# Altium schematic sheet Schematic - Power Driver.SchDoc
size A; SheetNumber: 1; SheetTotal: 2
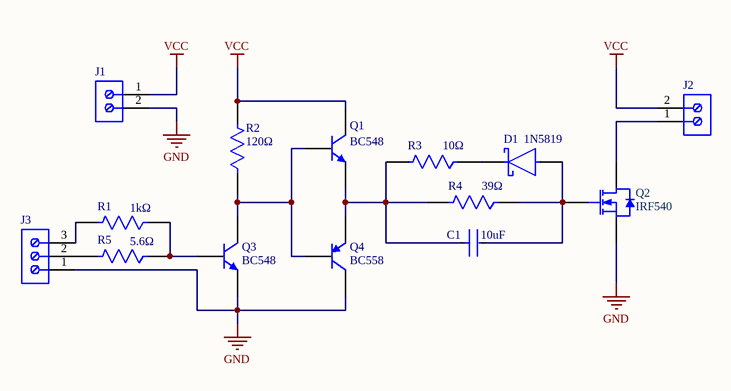
[diagram p0: Schematic - Power Driver.SchDoc]

## Parts
C1  10uF  [FP-BFC233860472-MFG]
D1  1N5819  [FP-1N5819-E3-54-MFG]
J1  1725656  [PHOE-1725656-2]  (value not drawn)
J2  1725656  [PHOE-1725656-2]  (value not drawn)
J3  691214110003  [691214110003]  (value not drawn)
Q1  BC548  [ONSC-TO-92-3-29-11_AM_BL]
Q2  IRF540  [VISH-TO-220AB-3_A]
Q3  BC548  [ONSC-TO-92-3-29-11_AM_BL]
Q4  BC558  [ONSC-TO-92-3-29-11_AM_BL]
R1  1kΩ  [FP-CF14-MFG]
R2  120Ω  [FP-CF14-MFG]
R3  10Ω  [FP-CF14-MFG]
R4  39Ω  [FP-CF14-MFG]
R5  5.6Ω  [FP-CF14-MFG]

## Nets
GND: J1.2 J3.1 Q2.3(S) Q3.3(E) Q4.1(C)
VCC: J1.1 J2.2 Q1.1(C) R2.2
NetC1_1: C1.1 Q1.3(E) Q4.3(E) R3.2 R4.2
NetC1_2: C1.2 D1.2(A) Q2.1(G) R4.1
NetD1_1: D1.1(C) R3.1
NetJ2_1: J2.1 Q2.2(D)
NetJ3_2: J3.2 R5.2
NetJ3_3: J3.3 R1.2
NetQ1_2: Q1.2(B) Q3.1(C) Q4.2(B) R2.1
NetQ3_2: Q3.2(B) R1.1 R5.1

## Library data of the parts
C1 = CMP-2000-05947-2: CAP FILM 4700PF 20% 1KVDC RADIAL; Dielectric: PP; Insulation Resistance: 15GR; Capacitance: 4.7nF; Voltage Rating (AC): 300V; Lead Length: 3.5mm; Lead Diameter: 0.5mm; Voltage Rating (DC): 1kV; Tolerance: 5%; Series: MKP338 6 Y2; Height - Seated (Max): 0.453inch; Max Operating Temperature: 105°C; Min Operating Temperature: -55°C; Case/Package: Radial; Dielectric Material: PP; Mount: Through Hole; Construction: RADIAL; Termination: Radial; Lead Pitch: 7.5mm; Length: 10mm; Radiation Hardening: No; Voltage: 300V; Contact Plating: Tin; Width: 6mm; Package Quantity: 750; RoHS Compliant: Yes; Depth: 6mm; Packaging: Bulk; Height: 11.5mm; Lead Free: Lead Free
D1 = CMP-02539-000037-2: DIODE SCHOTTKY 40V 1A DO204AL; Capacitance: 110pF; Element Configuration: Single; Peak Non-Repetitive Surge Current: 25A; Forward Voltage: 900mV; Polarity: Standard; Peak Reverse Current: 1mA; Max Operating Temperature: 125°C; Forward Current: 1A; Package Quantity: 1; Average Rectified Current: 1A; Voltage: 40V; Radiation Hardening: No; Current: 1A; Max Reverse Voltage (DC): 40V; Height: 2.7mm; Output Current: 1A; Lead Free: Lead Free; Diameter: 2.7mm; Min Operating Temperature: -65°C; Max Repetitive Reverse Voltage (Vrrm): 40V; Number of Pins: 2; Width: 2.7mm; Length: 5.2mm; Current Rating: 1A; Packaging: Tape and Reel; Mount: Through Hole; Max Forward Surge Current (Ifsm): 25A; Voltage Rating (DC): 40V
J1 J2 = CMP-2000-05299-1: Male Header, Pitch 2.54 mm, 1 x 2 Position, Height 9 mm, Tail Length 3.5 mm; Manufacturer: Phoenix Contact; Number of contacts: 2; Content: 250pc(s); Pitch: 2.54mm; Industrial packaging: Yes; Colour: Green; Manufacturer part No.: 1725656; Type: MPT0,5/2-2,54; Datasheet URL: http://datasheet.octopart.com/1725656-Phoenix-Contact-datasheet-5302866.pdf; Manufacturer URL: http://www.phoenixcontact.com/; Datasheet Version: Apr-08
J3 = CMP-1502-02466-2: NexarPartId: 18818289; Number of Levels: 1; Voltage: 300V; Pitch: 3.5052mm; Stripping Length: -6mm; Number of Positions Per Level: 3; Plating: Brass, Steel; Wire/Cable Gauge: 24AWG; Wire Gauge (Min): 16AWG; Current Rating: 10A; Width: 10.9mm; Length: 7.4mm; Housing Material: Nylon; Height: 12.2mm; Min Operating Temperature: -40°C; Contact Plating: Brass, Tin; Packaging: Box; Color: Blue, Green; Number of Contacts: 3; Number of Pins: 3; Voltage Rating: 300V; Termination: Screw; Lead Pitch: 3.5mm; Max Operating Temperature: 105°C; Mount: Through Hole; Contact Material: Brass; RoHS: Compliant; Wire Gauge (Max): 24AWG; Current: 10A; REACH SVHC: Unknown
Q1 Q3 = CMP-1048-01603-1: Amplifier Transistor, NPN Silicon, 3-Pin TO-92, Pb-Free, Tape and Reel; Manufacturer: On Semiconductor; PartNumber: BC548BRL1G; fT Min (MHz): 150; IC Continuous (A): 0.1; ComponentLink3Description: Package Specification; ComponentLink1Description: Manufacturer URL; Packing: Tape and Reel; ComponentLink1URL: http://www.onsemi.com/; PackageReference: TO-92-3-29-11_AM_BL; Polarity: NPN; ComponentLink3URL: http://www.onsemi.com/pub_link/Collateral/MAC97-D.PDF; DatasheetVersion: Rev. 7; PackageDescription: 3-Pin Transistor Outline, Body 4.825 x 3.685 mm, Pitch 1.27 mm; ComponentLink2Description: Datasheet; Mounting Technology: Through Hole; PackageVersion: Rev. AM; RoHS: TRUE; ComponentLink2URL: http://www.onsemi.com/pub_link/Collateral/BC546-D.PDF
Q2 = CMP-2000-06461-1: Power MOSFET, 100 VDS, -55 to 175 degC, 3-Pin TO-220AB, RoHS, Tube; Manufacturer: Vishay; Typical Turn-Off Delay Time: 53ns; Channel Mode: Enhancement; Unit Weight: 0.211644oz; Transistor Type: 1N-Channel; Vgs - Gate-Source Voltage: 20V; Transistor Polarity: N-Channel; Vds - Drain-Source Breakdown Voltage: 100V; Configuration: Single; Number of Channels: 1Channel; Pd - Power Dissipation: 150W; Brand: VishaySemiconductors; Rds On - Drain-Source Resistance: 77mOhms; Id - Continuous Drain Current: 28A; Rise Time: 44ns; Fall Time: 43ns; Typical Turn-On Delay Time: 11ns; &lt;PCN&gt;: http://www.mouser.com/PCN/Vishay_SIL_0182015.pdf; Maximum Operating Temperature: +175C; Product Category: MOSFET; Datasheet URL: http://www.vishay.com/docs/91021/91021.pdf; Length: 10.51mm; Height: 9.01mm; Factory Pack Quantity: 50; Width: 4.7mm; Packaging: Tube; Package Reference: TO-220AB-3; Package / Case: TO-220-3; Mounting Style: ThroughHole; Manufacturer URL: http://www.vishay.com/; Mounting Technology: ThroughHole; Package URL: http://www.vishay.com/docs/71195/to220ab.pdf; RoHS: NoRoHSVersionAvailable; Technology: Si; Minimum Operating Temperature: -55C; Package Description: 3-Pin Flange Mount, Body 10.275 x 4.45 mm, Pitch 2.54 mm; Datasheet Version: Rev. B, 03/2011
Q4 = CMP-1048-01513-1: Amplifier Transistor, PNP Silicon, 3-Pin TO-92, Pb-Free, Tape and Reel; Manufacturer: On Semiconductor; PartNumber: BC558BRL1G; IC Continuous (A): -0.1; ComponentLink1Description: Manufacturer URL; PackageReference: TO-92-3-29-11_AM_BL; ComponentLink3URL: http://www.onsemi.com/pub_link/Collateral/MAC97-D.PDF; ComponentLink1URL: http://www.onsemi.com/; Polarity: PNP; ComponentLink2Description: Datasheet; PackageDescription: 3-Pin Transistor Outline, Body 4.825 x 3.685 mm, Pitch 1.27 mm; ComponentLink2URL: http://www.onsemi.com/pub_link/Collateral/BC556B-D.PDF; DatasheetVersion: Rev. 3; ComponentLink3Description: Package Specification; Packing: Tape and Reel; RoHS: TRUE; Mounting Technology: Through Hole; PackageVersion: Rev. AM
R1-R5 = CMP-26528-000003-1: RES 7.5K OHM 1/4W 5% AXIAL; Max Power Dissipation: 250mW; Temperature Coefficient: -400ppm/°C; Resistance: 7.5kR; RoHS Compliant: Yes; Lead Free: Lead Free; Max Operating Temperature: 155°C; Case/Package: Axial; Tolerance: 5%; Power Rating: 250mW; Diameter: 2.3mm; Features: Flame Retardant Coating; Series: CF; Resistor Type: Carbon Film; Number of Terminations: 2; Length: 0.256inch; Min Operating Temperature: -55°C; Contact Plating: Tin; Packaging: Tape and Reel; Mount: Through Hole; Radiation Hardening: No